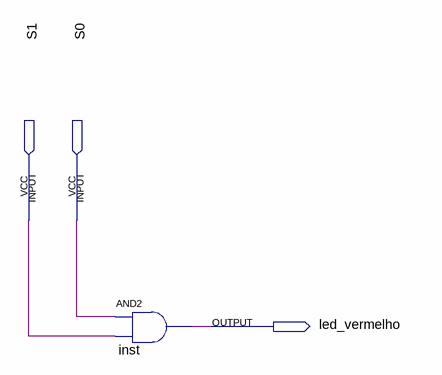
[diagram p0: schematic sheet]
// Quartus schematic saida_vermelho.bdf as structural Verilog: 1 symbols, 3 pins
module saida_vermelho (
  input  S1,
  input  S0,
  output led_vermelho
);

  and inst (led_vermelho, S0, S1);
endmodule
